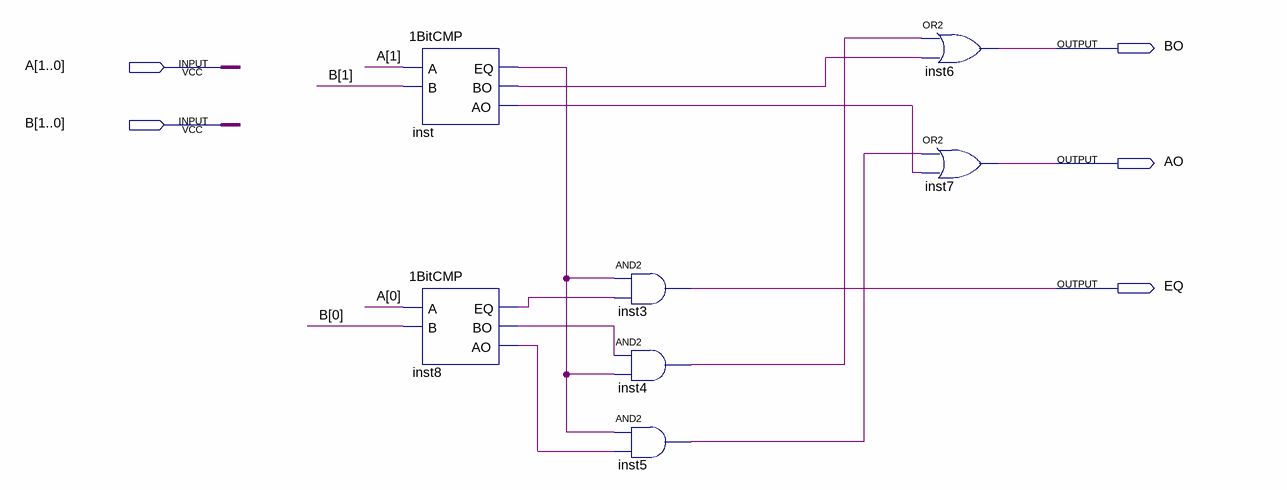
[diagram p0: schematic sheet]
// Quartus schematic 2BitCMP.bdf as structural Verilog: 7 symbols, 5 pins
module \2BitCMP  (
  input  [1:0] A,
  input  [1:0] B,
  output BO,
  output AO,
  output EQ
);

  wire inst4_out, inst5_out, inst8_ao, inst8_bo, inst8_eq, inst_ao, inst_bo, inst_eq;

  \1BitCMP  inst (.A(A[1]), .B(B[1]), .EQ(inst_eq), .BO(inst_bo), .AO(inst_ao));
  \1BitCMP  inst8 (.A(A[0]), .B(B[0]), .EQ(inst8_eq), .BO(inst8_bo), .AO(inst8_ao));
  and inst3 (EQ, inst_eq, inst8_eq);
  and inst4 (inst4_out, inst8_bo, inst_eq);
  and inst5 (inst5_out, inst_eq, inst8_ao);
  or inst6 (BO, inst4_out, inst_bo);
  or inst7 (AO, inst5_out, inst_ao);
endmodule
